# EAGLE design display v1 (EAGLE 9.6.1)
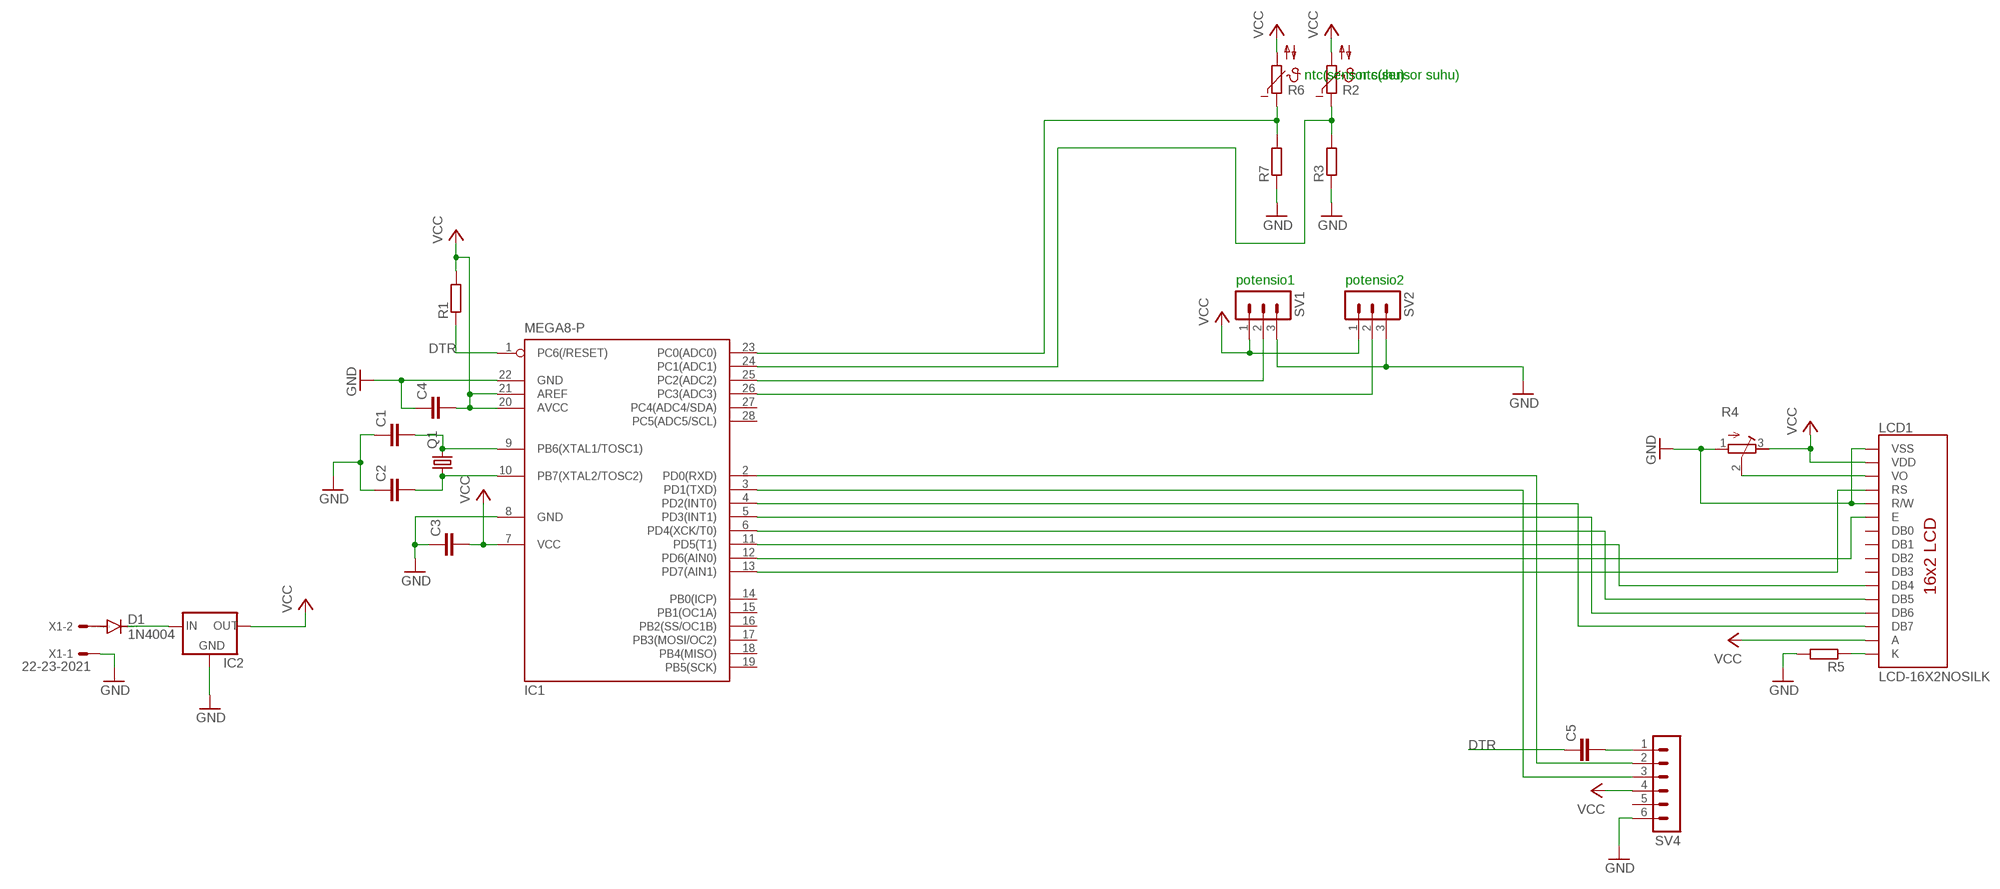
[diagram p0: schematic, sheet 1]

## Parts
C1  C-EU025-025X050  [C025-025X050]
C2  C-EU025-025X050  [C025-025X050]
C3  C-EU050-025X075  [C050-025X075]
C4  C-EU050-025X075  [C050-025X075]
C5  C-EU050-025X075  [C050-025X075]
D1  1N4004  [DO41-10]
IC1  MEGA8-P  [DIL28-3]
IC2  78XXL  [78XXL]
LCD1  LCD-16X2NOSILK  [LCD-16X2_NOSILK]
Q1  CRYSTALHC49S  [HC49/S]
R1  R-EU_0204/7  [0204/7]
R2  NTC642-6  [P642]
R3  R-EU_0204/7  [0204/7]
R4  R-TRIMM64W  [RTRIM64W]
R5  R-EU_0204/7  [0204/7]
R6  NTC642-6  [P642]
R7  R-EU_0204/7  [0204/7]
SV1  MA03-1  [MA03-1]
SV2  MA03-1  [MA03-1]
SV4  MA06-1  [MA06-1]
X1  22-23-2021  [22-23-2021]

## Nets
DTR: C5.1 IC1.1(PC6(/RESET)) R1.1
GND: C1.1 C2.1 C3.1 C4.1 IC1.8(GND) IC1.22(GND) IC2.GND LCD1.1(VSS) LCD1.5(R/W) R3.1 R4.1(A) R5.2 R7.1 SV1.3 SV2.3 SV4.6 X1.1
N$1: C1.2 IC1.9(PB6(XTAL1/TOSC1)) Q1.2
N$2: IC1.12(PD6(AIN0)) LCD1.6(E)
N$3: C2.2 IC1.10(PB7(XTAL2/TOSC2)) Q1.1
N$4: IC1.13(PD7(AIN1)) LCD1.4(RS)
N$6: IC1.23(PC0(ADC0)) R6.1 R7.2
N$7: D1.C IC2.IN
N$9: IC1.24(PC1(ADC1)) R2.1 R3.2
N$11: IC1.4(PD2(INT0)) LCD1.14(DB7)
N$12: IC1.5(PD3(INT1)) LCD1.13(DB6)
N$13: LCD1.3(VO) R4.2(S)
N$14: IC1.6(PD4(XCK/T0)) LCD1.12(DB5)
N$15: IC1.11(PD5(T1)) LCD1.11(DB4)
N$16: LCD1.16(K) R5.1
N$17: C5.2 SV4.1
N$18: IC1.2(PD0(RXD)) SV4.2
N$19: IC1.3(PD1(TXD)) SV4.3
N$20: D1.A X1.2
N$22: IC1.25(PC2(ADC2)) SV1.2
N$23: IC1.26(PC3(ADC3)) SV2.2
VCC: C3.2 C4.2 IC1.7(VCC) IC1.20(AVCC) IC1.21(AREF) IC2.OUT LCD1.2(VDD) LCD1.15(A) R1.2 R2.2 R4.3(E) R6.2 SV1.1 SV2.1 SV4.4
Unconnected: IC1.14(PB0(ICP)) IC1.15(PB1(OC1A)) IC1.16(PB2(SS/OC1B)) IC1.17(PB3(MOSI/OC2)) IC1.18(PB4(MISO)) IC1.19(PB5(SCK)) IC1.27(PC4(ADC4/SDA)) IC1.28(PC5(ADC5/SCL)) LCD1.7(DB0) LCD1.8(DB1) LCD1.9(DB2) LCD1.10(DB3) SV4.5

## Notes on the sheet
- ntc(sensor suhu) | ntc(sensor suhu)
- potensio1 | potensio2

## Library data of the parts
C1-C5 = rcl:C-EU: CAPACITOR, European symbol; SPICEPREFIX: C
D1 = diode:1N4004: DIODE general purpose rectifier, 1 A
IC1 = atmel:MEGA8-P: MICROCONTROLLER 8 Kbytes FLASH, 1 kbytes SRAM, 512 bytes EEPROM, USART, 4-channel 10 bit ADC, 2-channel 8 bit ADC Pin compatible with Atmega48, ATMega88, ATMega168 Source: avr.lbr; OC_FARNELL: unknown; OC_NEWARK: unknown
IC2 = v-reg:78XXL: VOLTAGE REGULATOR
LCD1 = SparkFun-Displays:LCD-16X2: Standard text-only 16x2 parallel input LCD Basic 16 character by 2 line display. Typically utilizes the extremely common HD44780 parallel interface chipset SparkFun Products: Basic 16x2 Green <https://www.sparkfun.com/products/255> Basic 8x2 Green <https://www.sparkfun.com/products/11122>; SF_ID: LCD-00255
Q1 = crystal:CRYSTAL: CRYSTAL; OC_FARNELL: 1667008; OC_NEWARK: unknown
R1 R3 R5 R7 = rcl:R-EU_: RESISTOR, European symbol; SPICEPREFIX: R
R2 R6 = ptc-ntc:NTC642-6: PHILIPS NTC; OC_FARNELL: unknown; OC_NEWARK: unknown
R4 = rcl:R-TRIMM: Trimm resistor; SPICEMODEL: X; SPICEPREFIXL: POT
SV1 SV2 = con-lstb:MA03-1: PIN HEADER; OC_FARNELL: unknown; OC_NEWARK: unknown
SV4 = con-lstb:MA06-1: PIN HEADER; OC_FARNELL: unknown; OC_NEWARK: unknown
X1 = con-molex:22-23-2021: .100" (2.54mm) Center Header - 2 Pin; MF: MOLEX; MPN: 22-23-2021; OC_FARNELL: 1462926; OC_NEWARK: 25C3832

## Board
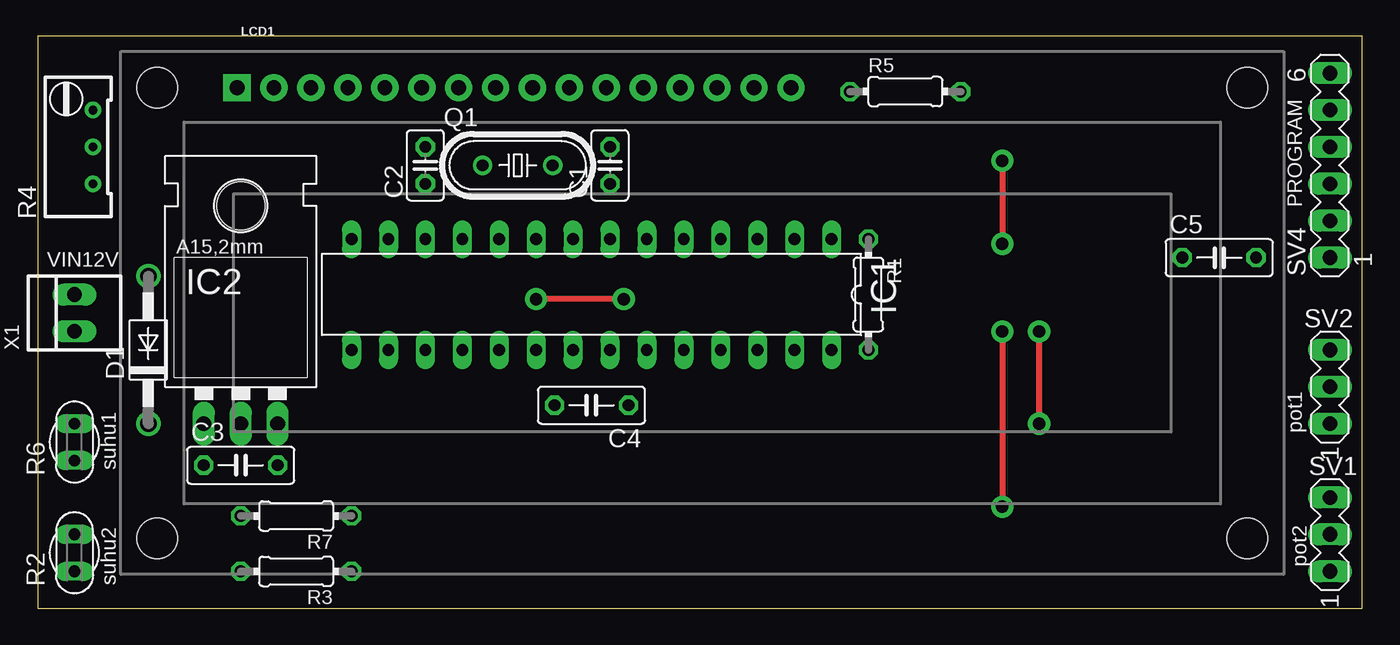
[diagram p1: board, top side]
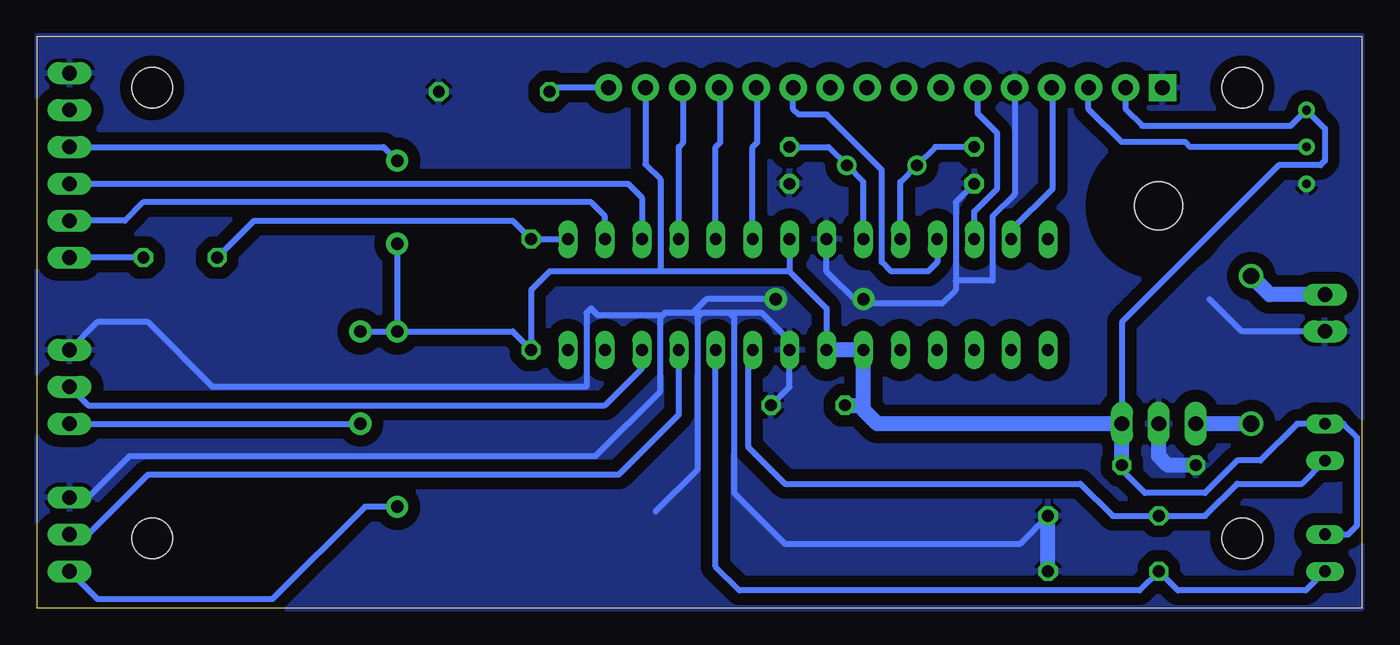
[diagram p2: board, bottom side, seen from below]

Size 91.11 x 39.36 mm. Coordinates in mm from the lower left corner, seen from the top.
Outline: 0,0 91.11,0 91.11,39.36 0,39.36 0,0
Copper layers (1*16): Top 0.035mm / dielectric 1.5mm / Bottom 0.035mm
Design rules "default *": minimum track width 6mil, minimum drill 0.35mm, track to track 6mil, track to pad 6mil, pad to pad 6mil, via to via 6mil, smd to smd 6mil, copper to edge 0mil, drill to drill 6mil, minimum pad ring 10mil, minimum via ring 8mil, stop-mask expansion 4mil, vias tented up to drill 0mil, thermal gap 10mil

### Footprints (pad centres in the part's own frame; a part is rotated, then mirrored left to right if it is on the bottom)
C025-025X050 = drill 0.813 octagon: 1 -1.27,0; 2 1.27,0
C050-025X075 = drill 0.813 octagon: 1 -2.54,0; 2 2.54,0
DO41-10 = drill 1.118: A 5.08,0; C -5.08,0
DIL28-3 = drill 0.813 long: 1 -16.51,-3.81; 2 -13.97,-3.81; 3 -11.43,-3.81; 4 -8.89,-3.81; 5 -6.35,-3.81; 6 -3.81,-3.81; 7 -1.27,-3.81; 8 1.27,-3.81; 9 3.81,-3.81; 10 6.35,-3.81; 11 8.89,-3.81; 12 11.43,-3.81; 13 13.97,-3.81; 14 16.51,-3.81; 15 16.51,3.81; 16 13.97,3.81; 17 11.43,3.81; 18 8.89,3.81; 19 6.35,3.81; 20 3.81,3.81; 21 1.27,3.81; 22 -1.27,3.81; 23 -3.81,3.81; 24 -6.35,3.81; 25 -8.89,3.81; 26 -11.43,3.81; 27 -13.97,3.81; 28 -16.51,3.81
78XXL = drill 1.016 long: GND 0,-3.81; IN -2.54,-3.81; OUT 2.54,-3.81 | hole 3.302: 0,11.176
LCD-16X2_NOSILK = drill 1.016 pad 1.88 square: 1 -32,15.5 | drill 1.016 pad 1.88: 2 -29.46,15.5; 3 -26.92,15.5; 4 -24.38,15.5; 5 -21.84,15.5; 6 -19.3,15.5; 7 -16.76,15.5; 8 -14.22,15.5; 9 -11.68,15.5; 10 -9.14,15.5; 11 -6.6,15.5; 12 -4.06,15.5; 13 -1.52,15.5; 14 1.02,15.5; 15 3.56,15.5; 16 6.1,15.5 | hole 2.8: -37.5,15.5; -37.5,-15.5; 37.5,15.5; 37.5,-15.5
HC49/S = drill 0.813: 1 -2.413,0; 2 2.413,0
0204/7 = drill 0.813 octagon: 1 -3.81,0; 2 3.81,0
P642 = drill 0.813 long: 1 -1.27,0; 2 1.27,0
RTRIM64W = drill 0.61: 1 1.27,-2.54; 2 1.27,0; 3 1.27,2.54
MA03-1 = drill 1.016 long: 1 -2.54,0; 2 0,0; 3 2.54,0
MA06-1 = drill 1.016 long: 1 -6.35,0; 2 -3.81,0; 3 -1.27,0; 4 1.27,0; 5 3.81,0; 6 6.35,0
22-23-2021 = drill 1 long: 1 -1.27,0; 2 1.27,0

### Placement (x,y rotation side)
C1  39.37,30.48 90 top
C2  26.67,30.48 90 top
C3  13.97,9.84 0 top
C4  38.1,13.97 180 top
C5  81.28,24.13 0 top
D1  7.62,17.78 90 top
IC1  38.1,21.59 180 top
IC2  13.97,16.51 0 top
LCD1  45.72,20.32 0 top
Q1  33.02,30.48 0 top
R1  57.15,21.59 270 top
R2  2.54,3.81 90 top
R3  17.78,2.54 180 top
R4  2.54,31.75 0 top
R5  59.69,35.56 0 top
R6  2.54,11.43 90 top
R7  17.78,6.35 180 top
SV1  88.9,5.08 90 top
SV2  88.9,15.24 90 top
SV4  88.9,30.48 90 top
X1  2.54,20.32 90 top

### Tracks (layer width: path | path; a pad name or v marks a point on that pad's centre or on a via)
DTR
  Bottom 0.406: C5.1 76.2,26.67 58.42,26.67 R1.1 IC1.1
GND  (via drill 0.85 pad 1.52)
  Top 0.406: v40.32,21.27 v34.29,21.27
  Bottom 0.406: C4.1 39.37,15.24 IC1.22 39.37,18.41 41.28,20.32 43.5,20.32 | SV1.3 87.63,7.62 84.77,10.48 52.71,10.48 48.26,14.92 48.26,20 48.1,20.16 | 48.1,20.16 47.94,20.32 46.04,20.32 | 43.5,20.32 45.4,20.32 | 45.4,20.32 46.04,20.32 | X1.1 8.26,19.05 10.48,21.27 | C2.1 27.94,27.94 27.94,22.54 | IC1.8 36.83,23.18 34.61,20.95 28.89,20.95 27.94,21.91 27.94,22.54 | 43.5,20.32 43.18,20 43.18,7.94 39.69,4.45 23.5,4.45 R7.1 | LCD1.5 23.88,28.51 25.4,26.99 25.4,22.54 27.94,22.54 | 48.1,20.16 52.55,20.16 53.02,20.64 53.34,20.32 53.34,15.24 79.06,15.24 83.5,19.68 86.99,19.68 SV2.3 | v40.32,21.27 45.09,21.27 46.04,20.32 | 45.4,20.32 45.72,20 45.72,9.53 48.58,6.67
  Bottom 1.016: C3.1 13.33,9.84 13.97,10.48 IC2.GND | R3.1 R7.1
  pour Bottom (isolate 0.813): 0,39.37 91.12,39.37 91.12,0 0,0
N$1
  Bottom 0.406: C1.2 36.7,31.75 Q1.2 34.29,29.34 IC1.9
N$2
  Bottom 0.406: IC1.12 26.67,27.3 25.08,28.89 25.08,32.7 26.42,34.04 LCD1.6
N$3
  Bottom 0.406: C2.2 29.34,31.75 Q1.1 31.75,29.34 IC1.10
N$4
  Bottom 0.406: IC1.13 24.13,26.04 21.27,28.89 21.27,35.75 LCD1.4
N$6
  Bottom 0.406: IC1.23 41.91,17.14 42.23,16.83 42.23,11.11 39.69,8.57 19.37,8.57 17.14,6.35 R7.2 10.79,6.35 8.57,8.57 4.13,8.57 R6.1
N$7
  Bottom 1.016: D1.C IC2.IN
N$9
  Bottom 0.406: R2.1 3.86,1.22 12.65,1.22 R3.2 15.29,1.22 42.81,1.22 44.45,2.86 IC1.24
N$11
  Bottom 0.406: IC1.4 46.99,31.75 46.67,32.07 46.67,35.75 LCD1.14
N$12
  Bottom 0.406: IC1.5 44.45,31.75 44.13,32.07 44.13,35.75 LCD1.13
N$13
  Bottom 0.406: R4.2 11.82,31.75 12.15,32.08 16.52,32.08 18.8,34.36 LCD1.3
N$14
  Bottom 0.406: IC1.6 41.91,31.75 41.59,32.07 41.59,35.75 LCD1.12
N$15
  Bottom 0.406: IC1.11 29.21,23.81 29.84,23.18 32.38,23.18 33.02,23.81 33.02,30.16 36.83,33.97 38.74,33.97 39.12,34.36 LCD1.11
N$16
  Bottom 0.406: LCD1.16 55.62,35.82 R5.1
N$17
  Bottom 0.406: C5.2 SV4.1
N$18
  Bottom 0.406: IC1.2 52.07,26.99 53.02,27.94 83.82,27.94 85.09,26.67 SV4.2
N$19
  Bottom 0.406: SV4.3 50.48,29.21 49.53,28.26 IC1.3
N$20
  Bottom 1.016: X1.2 6.35,21.59 D1.A
N$22
  Bottom 0.406: SV1.2 87.63,5.08 83.5,9.21 51.12,9.21 46.99,13.34 IC1.25
N$23
  Bottom 0.406: SV2.2 87.63,13.97 52.07,13.97 49.53,16.51 IC1.26
VCC  (via drill 0.85 pad 1.52)
  Top 0.406: v66.36,30.8 v66.36,25.08 | v66.36,19.05 v66.36,6.99 | v68.9,12.7 v68.9,19.05
  Bottom 0.406: LCD1.2 16.26,34.36 15.1,33.2 4.9,33.2 R4.3 2.54,33.02 2.54,30.8 2.86,30.48 5.71,30.48 16.51,19.68 IC2.OUT | LCD1.15 49.28,30.55 48.26,29.53 48.26,23.18 | IC1.21 36.83,20.64 39.37,23.18 | 39.37,23.18 48.26,23.18 | IC1.7 39.37,23.18 | C3.2 16.51,9.53 14.92,7.94 10.79,7.94 8.57,10.16 6.98,10.16 4.45,12.7 R6.2 1.27,12.7 0.32,11.75 0.32,5.71 0.95,5.08 R2.2 | SV1.1 86.99,0.64 74.93,0.64 68.58,6.99 v66.36,6.99 | SV4.4 67.31,31.75 v66.36,30.8 | v66.36,25.08 v66.36,19.05 | v66.36,19.05 58.42,19.05 R1.2 57.15,21.91 55.88,23.18 48.26,23.18 | SV2.1 v68.9,12.7 | v68.9,19.05 v66.36,19.05
  Bottom 1.016: C3.2 IC2.OUT 33.34,12.7 34.29,13.65 34.29,14.29 | 34.29,14.29 IC1.20 IC1.21 | C4.2 34.61,13.97 34.29,14.29

### Text on the board
tNames: PROGRAM | VIN12V | pot1 | suhu1 | pot2 | suhu2